# Altium schematic sheet 11-M2_RCB_MUX.SchDoc
size B; SheetNumber: 11; SheetTotal: 16
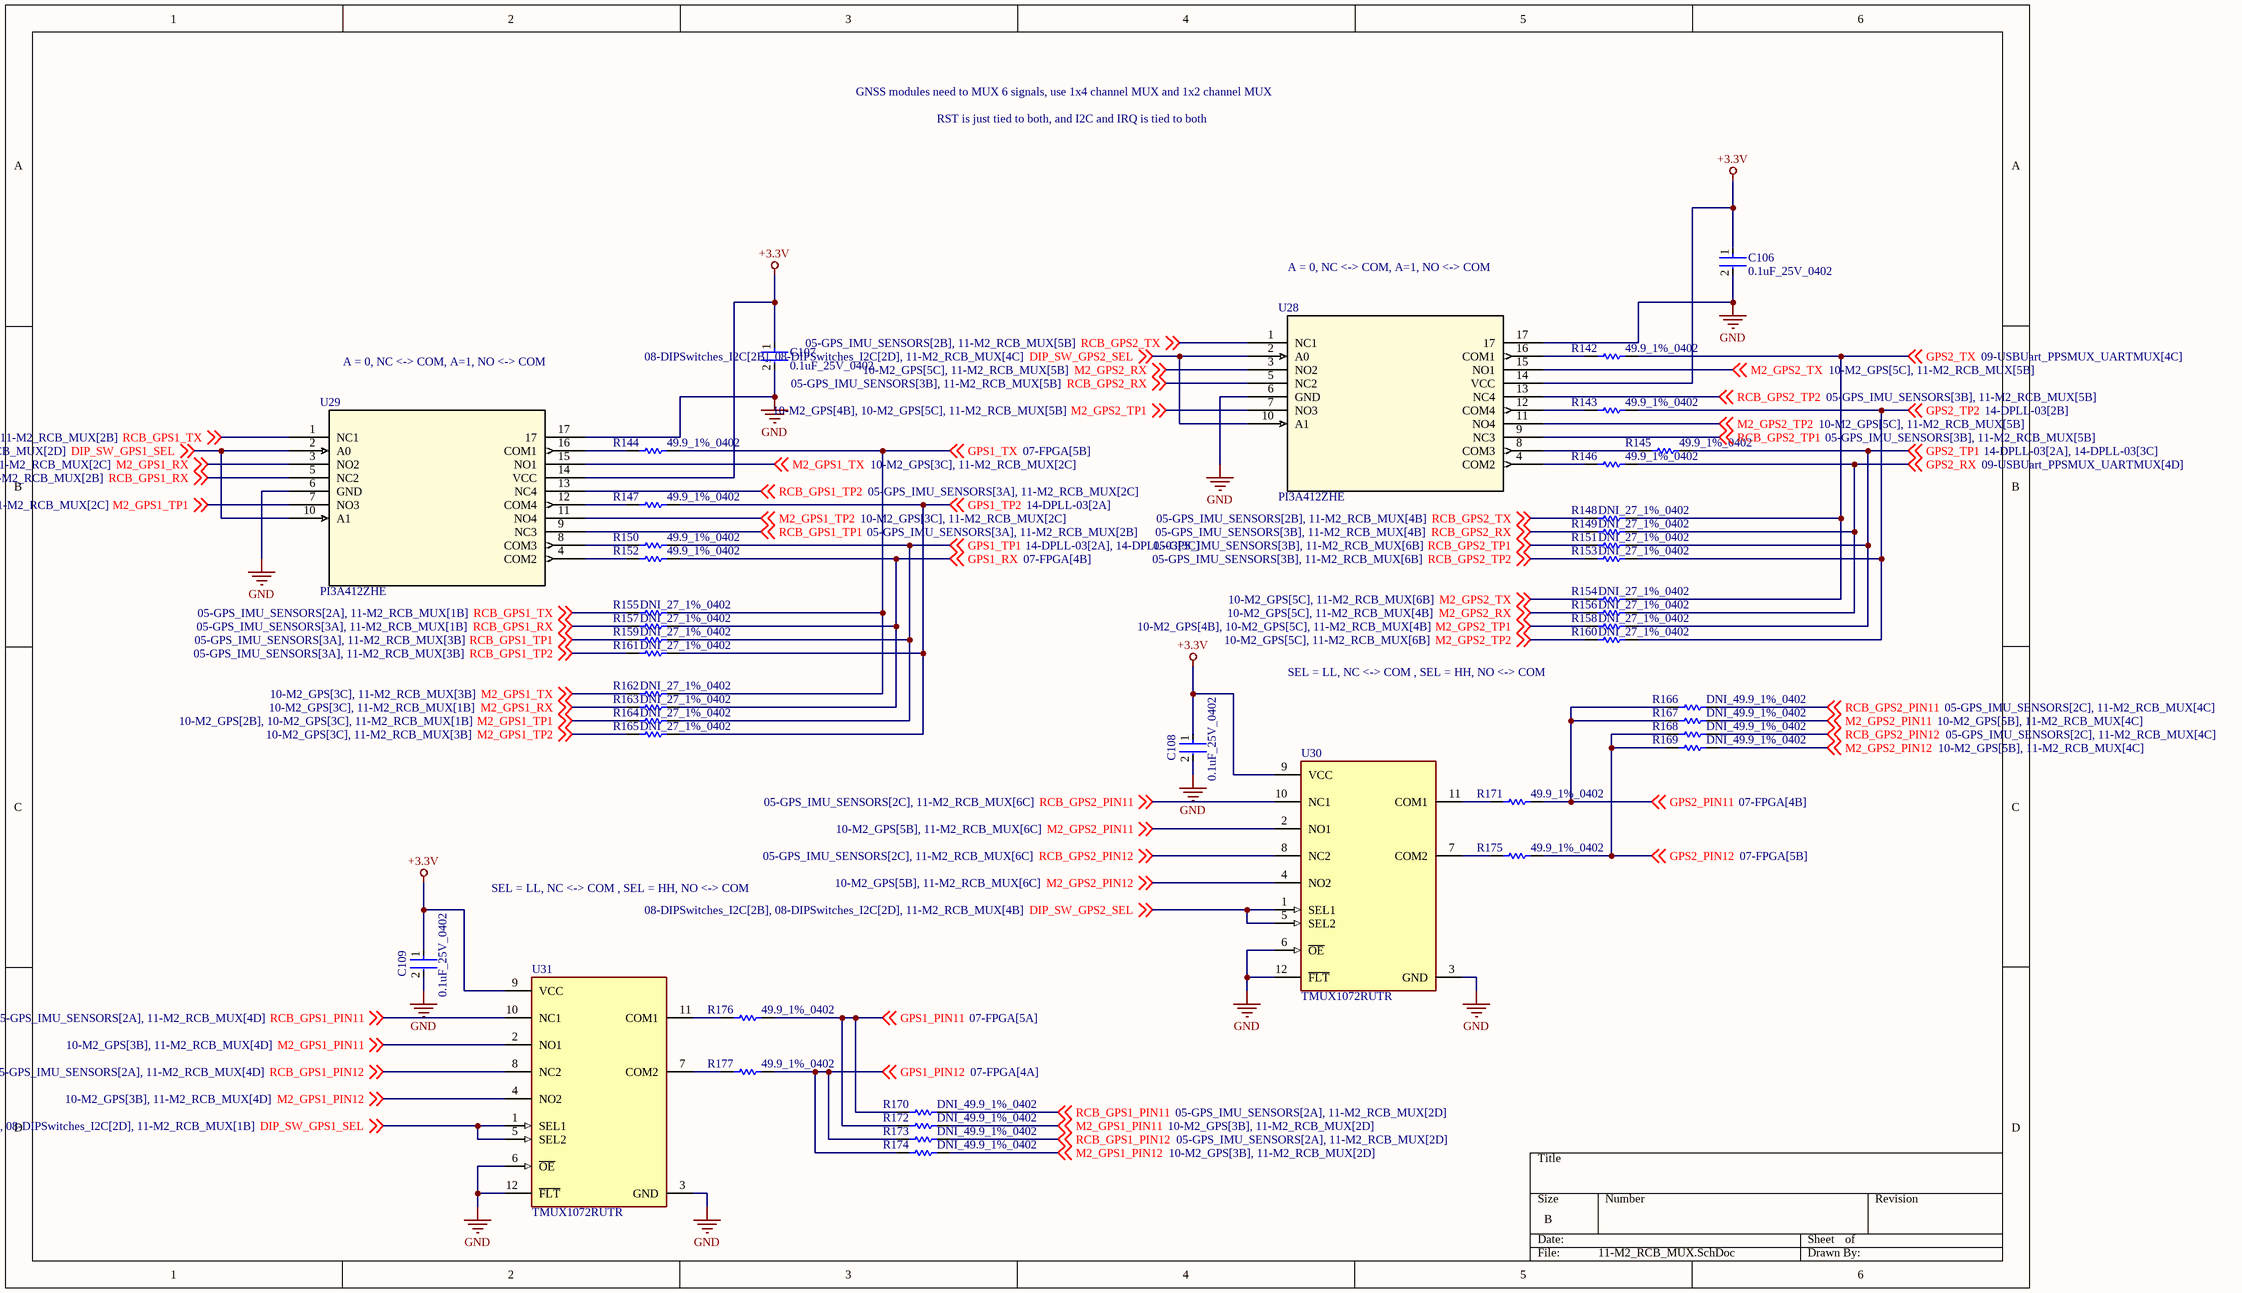
[diagram p0: 11-M2_RCB_MUX.SchDoc]

## Parts
C106  0.1uF_25V_0402  [FP-0402-L_1_0_1-W_0_5_0_1-IPC_C]
C107  0.1uF_25V_0402  [FP-0402-L_1_0_1-W_0_5_0_1-IPC_C]
C108  0.1uF_25V_0402  [FP-0402-L_1_0_1-W_0_5_0_1-IPC_C]
C109  0.1uF_25V_0402  [FP-0402-L_1_0_1-W_0_5_0_1-IPC_C]
R142  49.9_1%_0402  [RESC1005X40X25LL05T10]
R143  49.9_1%_0402  [RESC1005X40X25LL05T10]
R144  49.9_1%_0402  [RESC1005X40X25LL05T10]
R145  49.9_1%_0402  [RESC1005X40X25LL05T10]
R146  49.9_1%_0402  [RESC1005X40X25LL05T10]
R147  49.9_1%_0402  [RESC1005X40X25LL05T10]
R148  DNI_27_1%_0402  [RESC1005X40X25NL05T05]  (no BOM)
R149  DNI_27_1%_0402  [RESC1005X40X25NL05T05]  (no BOM)
R150  49.9_1%_0402  [RESC1005X40X25LL05T10]
R151  DNI_27_1%_0402  [RESC1005X40X25NL05T05]  (no BOM)
R152  49.9_1%_0402  [RESC1005X40X25LL05T10]
R153  DNI_27_1%_0402  [RESC1005X40X25NL05T05]  (no BOM)
R154  DNI_27_1%_0402  [RESC1005X40X25NL05T05]  (no BOM)
R155  DNI_27_1%_0402  [RESC1005X40X25NL05T05]  (no BOM)
R156  DNI_27_1%_0402  [RESC1005X40X25NL05T05]  (no BOM)
R157  DNI_27_1%_0402  [RESC1005X40X25NL05T05]  (no BOM)
R158  DNI_27_1%_0402  [RESC1005X40X25NL05T05]  (no BOM)
R159  DNI_27_1%_0402  [RESC1005X40X25NL05T05]  (no BOM)
R160  DNI_27_1%_0402  [RESC1005X40X25NL05T05]  (no BOM)
R161  DNI_27_1%_0402  [RESC1005X40X25NL05T05]  (no BOM)
R162  DNI_27_1%_0402  [RESC1005X40X25NL05T05]  (no BOM)
R163  DNI_27_1%_0402  [RESC1005X40X25NL05T05]  (no BOM)
R164  DNI_27_1%_0402  [RESC1005X40X25NL05T05]  (no BOM)
R165  DNI_27_1%_0402  [RESC1005X40X25NL05T05]  (no BOM)
R166  DNI_49.9_1%_0402  [RESC1005X40X25LL05T10]  (no BOM)
R167  DNI_49.9_1%_0402  [RESC1005X40X25LL05T10]  (no BOM)
R168  DNI_49.9_1%_0402  [RESC1005X40X25LL05T10]  (no BOM)
R169  DNI_49.9_1%_0402  [RESC1005X40X25LL05T10]  (no BOM)
R170  DNI_49.9_1%_0402  [RESC1005X40X25LL05T10]  (no BOM)
R171  49.9_1%_0402  [RESC1005X40X25LL05T10]
R172  DNI_49.9_1%_0402  [RESC1005X40X25LL05T10]  (no BOM)
R173  DNI_49.9_1%_0402  [RESC1005X40X25LL05T10]  (no BOM)
R174  DNI_49.9_1%_0402  [RESC1005X40X25LL05T10]  (no BOM)
R175  49.9_1%_0402  [RESC1005X40X25LL05T10]
R176  49.9_1%_0402  [RESC1005X40X25LL05T10]
R177  49.9_1%_0402  [RESC1005X40X25LL05T10]
U28  PI3A412ZHE  [ZH16_PER]
U29  PI3A412ZHE  [ZH16_PER]
U30  TMUX1072RUTR  [FP-RUT0012A-MFG]
U31  TMUX1072RUTR  [FP-RUT0012A-MFG]

## Nets
+3.3V: C106.1 C107.1 C108.1 C109.1 U28.14(VCC) U29.14(VCC) U30.9(VCC) U31.9(VCC)
GND: C106.2 C107.2 C108.2 C109.2 U28.6(GND) U28.17 U29.6(GND) U29.17 U30.3(GND) U30.6(~{OE}) U30.12(~{FLT}) U31.3(GND) U31.6(~{OE}) U31.12(~{FLT})
DIP_SW_GPS1_SEL: U29.2(A0) U29.10(A1) U31.1(SEL1) U31.5(SEL2) ; off-sheet DIP_SW_GPS1_SEL
DIP_SW_GPS2_SEL: U28.2(A0) U28.10(A1) U30.1(SEL1) U30.5(SEL2) ; off-sheet DIP_SW_GPS2_SEL
GPS1_PIN11: R170.1 R172.1 R176.2 ; off-sheet GPS1_PIN11
GPS1_PIN12: R173.1 R174.1 R177.2 ; off-sheet GPS1_PIN12
GPS1_RX: R152.2 R157.2 R163.2 ; off-sheet GPS1_RX
GPS1_TP1: R150.2 R159.2 R164.2 ; off-sheet GPS1_TP1
GPS1_TP2: R147.2 R161.2 R165.2 ; off-sheet GPS1_TP2
GPS1_TX: R144.2 R155.2 R162.2 ; off-sheet GPS1_TX
GPS2_PIN11: R166.1 R167.1 R171.2 ; off-sheet GPS2_PIN11
GPS2_PIN12: R168.1 R169.1 R175.2 ; off-sheet GPS2_PIN12
GPS2_RX: R146.2 R149.2 R156.2 ; off-sheet GPS2_RX
GPS2_TP1: R145.2 R151.2 R158.2 ; off-sheet GPS2_TP1
GPS2_TP2: R143.2 R153.2 R160.2 ; off-sheet GPS2_TP2
GPS2_TX: R142.2 R148.2 R154.2 ; off-sheet GPS2_TX
M2_GPS1_PIN11: R172.2 U31.2(NO1) ; off-sheet M2_GPS1_PIN11
M2_GPS1_PIN12: R174.2 U31.4(NO2) ; off-sheet M2_GPS1_PIN12
M2_GPS1_RX: R163.1 U29.3(NO2) ; off-sheet M2_GPS1_RX
M2_GPS1_TP1: R164.1 U29.7(NO3) ; off-sheet M2_GPS1_TP1
M2_GPS1_TP2: R165.1 U29.11(NO4) ; off-sheet M2_GPS1_TP2
M2_GPS1_TX: R162.1 U29.15(NO1) ; off-sheet M2_GPS1_TX
M2_GPS2_PIN11: R167.2 U30.2(NO1) ; off-sheet M2_GPS2_PIN11
M2_GPS2_PIN12: R169.2 U30.4(NO2) ; off-sheet M2_GPS2_PIN12
M2_GPS2_RX: R156.1 U28.3(NO2) ; off-sheet M2_GPS2_RX
M2_GPS2_TP1: R158.1 U28.7(NO3) ; off-sheet M2_GPS2_TP1
M2_GPS2_TP2: R160.1 U28.11(NO4) ; off-sheet M2_GPS2_TP2
M2_GPS2_TX: R154.1 U28.15(NO1) ; off-sheet M2_GPS2_TX
RCB_GPS1_PIN11: R170.2 U31.10(NC1) ; off-sheet RCB_GPS1_PIN11
RCB_GPS1_PIN12: R173.2 U31.8(NC2) ; off-sheet RCB_GPS1_PIN12
RCB_GPS1_RX: R157.1 U29.5(NC2) ; off-sheet RCB_GPS1_RX
RCB_GPS1_TP1: R159.1 U29.9(NC3) ; off-sheet RCB_GPS1_TP1
RCB_GPS1_TP2: R161.1 U29.13(NC4) ; off-sheet RCB_GPS1_TP2
RCB_GPS1_TX: R155.1 U29.1(NC1) ; off-sheet RCB_GPS1_TX
RCB_GPS2_PIN11: R166.2 U30.10(NC1) ; off-sheet RCB_GPS2_PIN11
RCB_GPS2_PIN12: R168.2 U30.8(NC2) ; off-sheet RCB_GPS2_PIN12
RCB_GPS2_RX: R149.1 U28.5(NC2) ; off-sheet RCB_GPS2_RX
RCB_GPS2_TP1: R151.1 U28.9(NC3) ; off-sheet RCB_GPS2_TP1
RCB_GPS2_TP2: R153.1 U28.13(NC4) ; off-sheet RCB_GPS2_TP2
RCB_GPS2_TX: R148.1 U28.1(NC1) ; off-sheet RCB_GPS2_TX
NetR142_1: R142.1 U28.16(COM1)
NetR143_1: R143.1 U28.12(COM4)
NetR144_1: R144.1 U29.16(COM1)
NetR145_1: R145.1 U28.8(COM3)
NetR146_1: R146.1 U28.4(COM2)
NetR147_1: R147.1 U29.12(COM4)
NetR150_1: R150.1 U29.8(COM3)
NetR152_1: R152.1 U29.4(COM2)
NetR171_1: R171.1 U30.11(COM1)
NetR175_1: R175.1 U30.7(COM2)
NetR176_1: R176.1 U31.11(COM1)
NetR177_1: R177.1 U31.7(COM2)

## Notes on the sheet
- GNSS modules need to MUX 6 signals, use 1x4 channel MUX and 1x2 channel MUX
- RST is just tied to both, and I2C and IRQ is tied to both
- A = 0, NC <-> COM, A=1, NO <-> COM
- SEL = LL, NC <-> COM , SEL = HH, NO <-> COM

## Library data of the parts
C106-C109 = CMP-2008-02519-2: General Purpose Ceramic Capacitor, 0402, 100nF, 10%, X7R, 15%, 25V; Package Quantity: 1; Capacitance: 100nF; Min Operating Temperature: -55°C; Voltage: 25V; Voltage Rating: 25V; Construction: Flat; Max Operating Temperature: 125°C; Radiation Hardening: No; Depth: 0.5mm; Thickness: 0.022inch; Voltage Rating (DC): 25V; Number of Pins: 2; Lead Free: Lead Free; Series: -; REACH SVHC: No SVHC; Length: 1mm; Dielectric: X7R; RoHS Compliant: Yes; Mount: Surface Mount; Packaging: Tape and Reel; Case/Package: 0402; Case Code (Imperial): 0402; Termination: SMD/SMT; Width: 0.02inch; Case Code (Metric): 1005; Tolerance: 10%
R142-R147 R150 R152 R166-R177 = CMP-2002-07709-1: Manufacturer: Yageo / Phycomp; Part Number: RC0402FR-0749R9L
R148 R149 R151 R153-R165 = CMP-2002-08434-1: Part Number: CRCW040227R0FKED; Manufacturer: Vishay Dale
U28 U29 = PI3A412ZHE: No Description Available; Mfr_Name: Pericom; RefDes: RefDes; Type: Type
U30 U31 = CMP-04892-000114-1: IC SWITCH SPDT DUAL 12UQFN; Number of Circuits: 2; -3db Bandwidth: 1.2GHz; On-State Resistance: 18R; Number of Pins: 12; Min Operating Temperature: -40°C; RoHS Compliant: Yes; Max Operating Temperature: 125°C; Number of Channels: 2; Packaging: Tape and Reel